# Altium schematic sheet S7CAS-PLEIADES-CARTE-MERE_Pxx_FLASH_PHY_CLOCK.SchDoc
size Tabloid; SheetNumber: 10; SheetTotal: 18; Sheet_Name: FLASH CLOCK; Size: 11x17
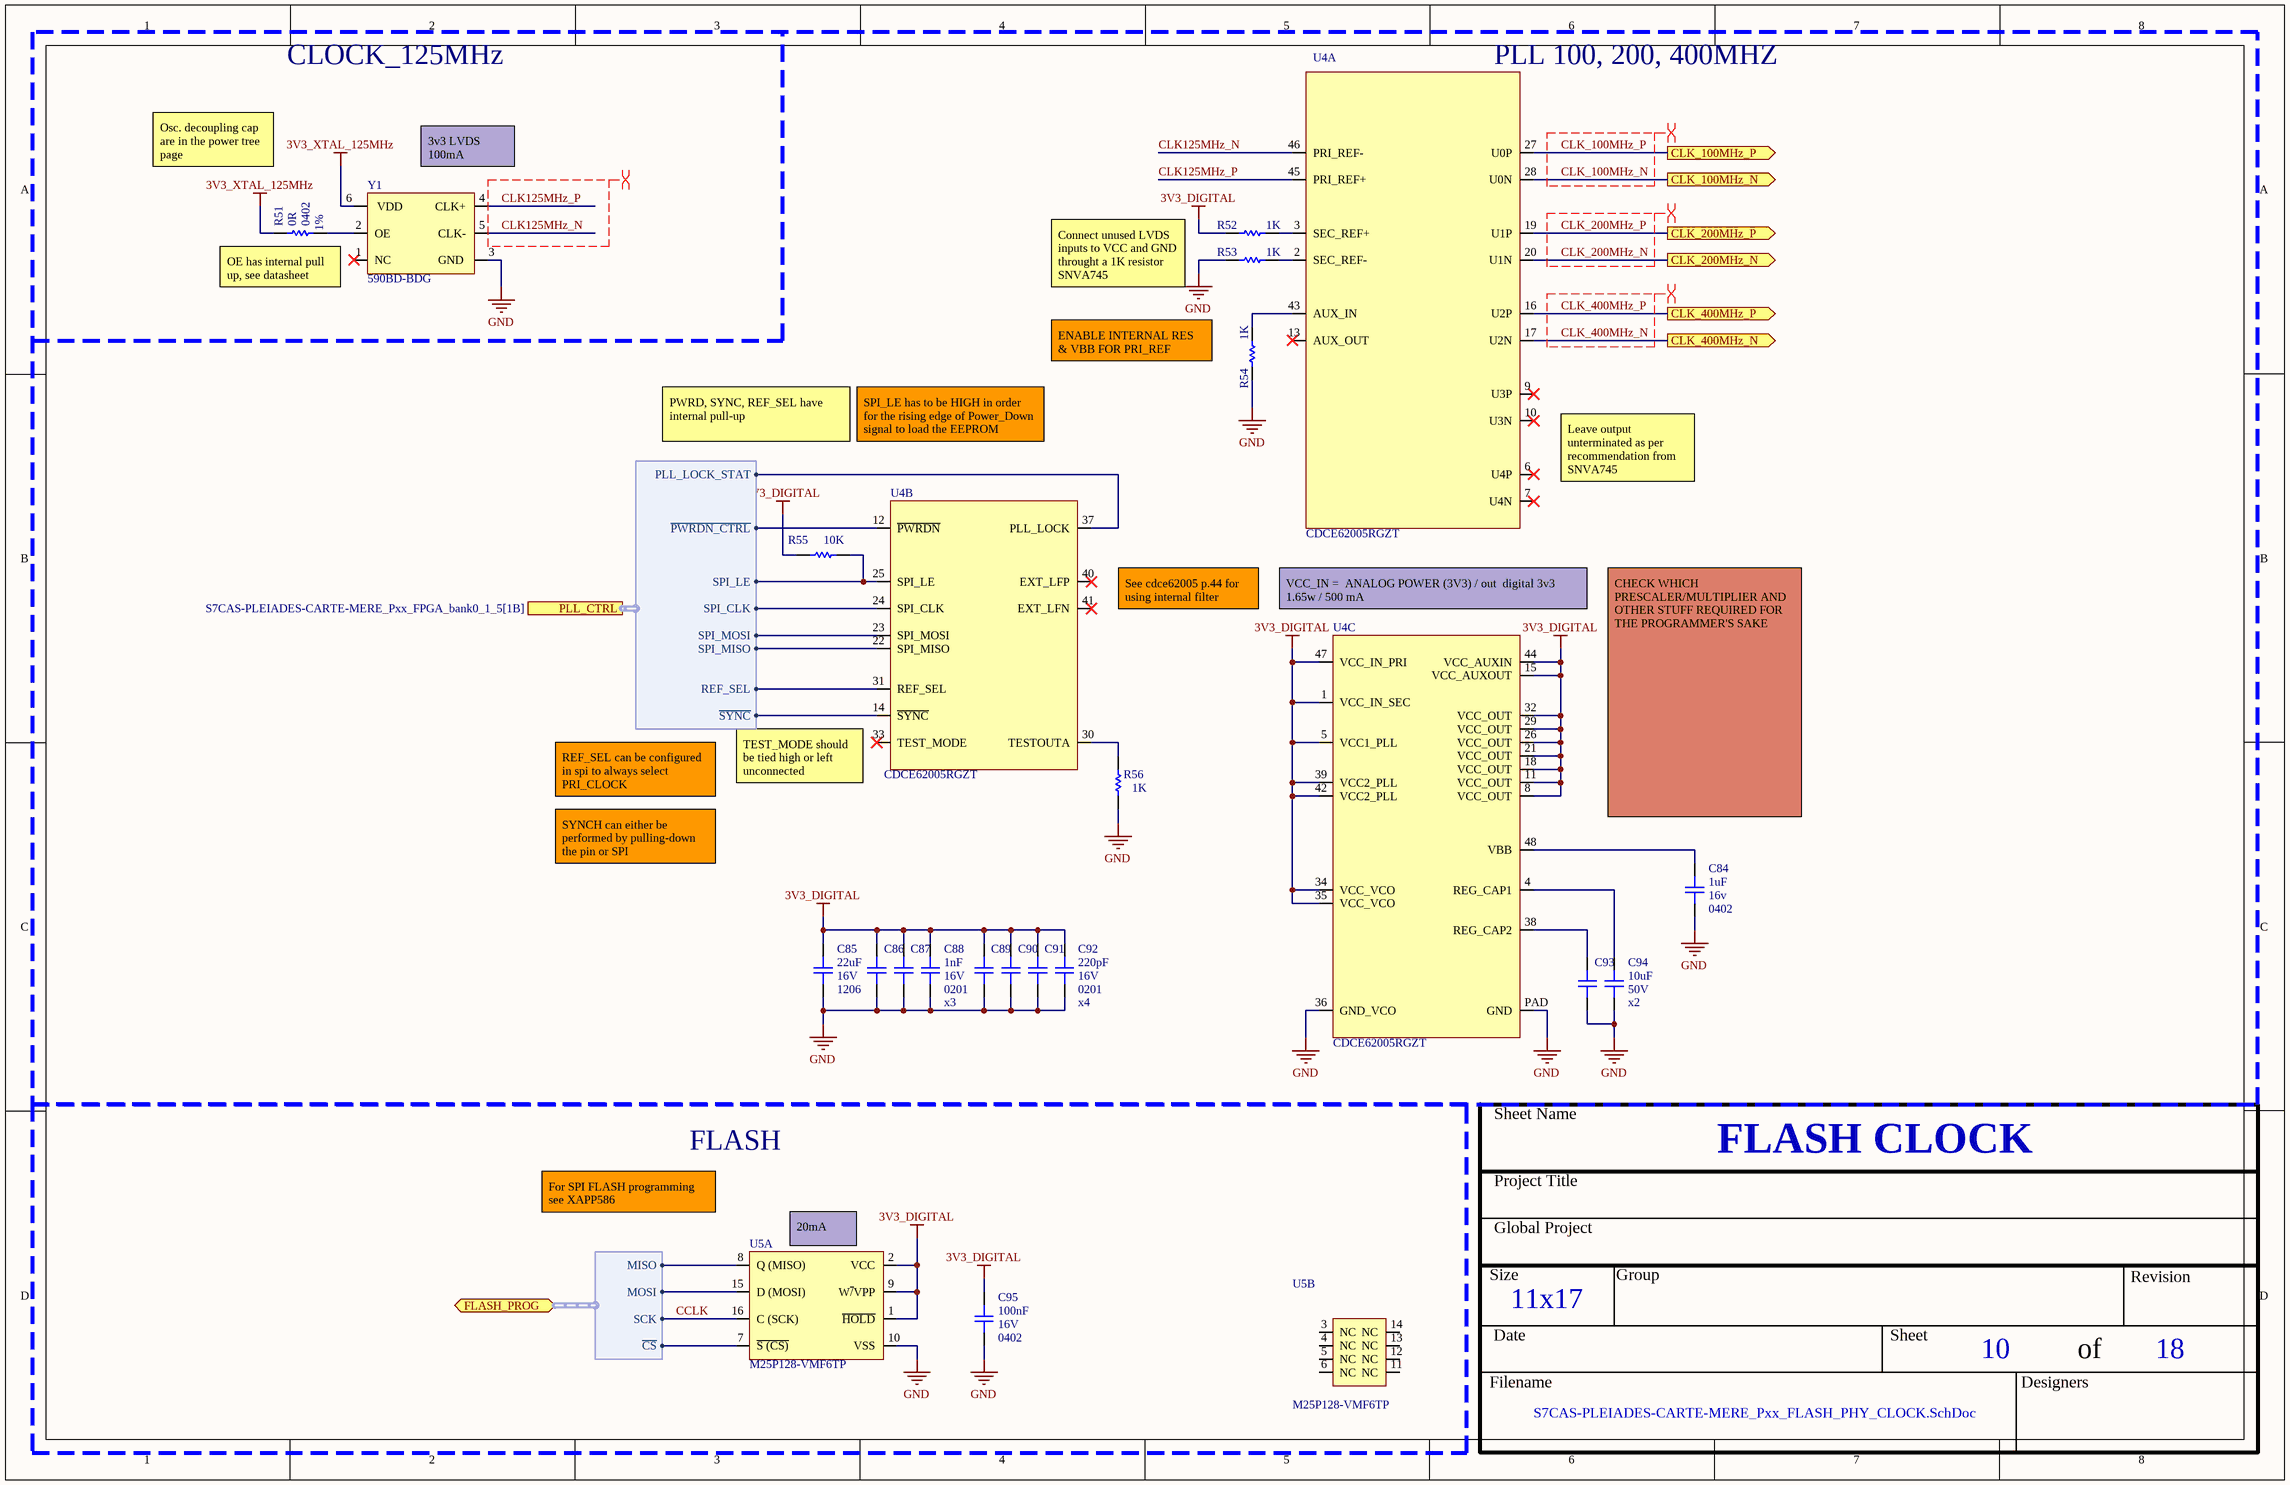
[diagram p0: S7CAS-PLEIADES-CARTE-MERE_Pxx_FLASH_PHY_CLOCK.SchDoc]

## Parts
C84  value 1uF  Voltage: 16v  [CAP_0402]  (hidden comment: 0402)
C85  value 22uF  Voltage: 16V  Package: 1206  [CAP_1206]  (hidden comment: CAP - 1206)
C86  CAP - 0201  [CAP_0201]  (value not drawn)
C87  CAP - 0201  [CAP_0201]  (value not drawn)
C88  value 1nF  Voltage: 16V  Package: 0201  [CAP_0201]  (hidden comment: CAP - 0201)
C89  CAP - 0201  [CAP_0201]  (value not drawn)
C90  CAP - 0201  [CAP_0201]  (value not drawn)
C91  CAP - 0201  [CAP_0201]  (value not drawn)
C92  value 220pF  Voltage: 16V  Package: 0201  [CAP_0201]  (hidden comment: CAP - 0201)
C93  CAP - 1206  [CAP_1206]  (value not drawn)
C94  value 10uF  Voltage: 50V  [CAP_1206]  (hidden comment: CAP - 1206)
C95  value 100nF  Voltage: 16V  [CAP_0402]  (hidden comment: 0402)
R51  value 0R  Package: 0402  Precision: 1%  [RES_0402]  (hidden comment: RES - 0603)
R52  value 1K  [RES_0402]  (hidden comment: RES - 0603)
R53  value 1K  [RES_0402]  (hidden comment: RES - 0603)
R54  value 1K  [RES_0402]  (hidden comment: RES - 0603)
R55  value 10K  [RES_0402]  (hidden comment: RES - 0603)
R56  value 1K  [RES_0402]  (hidden comment: RES - 0603)
U4  CDCE62005RGZT  [TIM_CDCE62005RGZT]  (parts A,B,C of 3)
U5  M25P128-VMF6TP  [FLASH - M25P128-VMF6TP]  (parts A,B of 2)
Y1  590BD-BDG  [OSC_590BD-BDG]

## Blocks framed on the sheet
FLASH: C95 U5

## Ports
CLK_100MHz_N (out, see S7CAS-PLEIADES-CARTE-MERE_Pxx_FPGA_bank0_1_5[4A]), CLK_100MHz_P (out, see S7CAS-PLEIADES-CARTE-MERE_Pxx_FPGA_bank0_1_5[4A]), CLK_200MHz_N (out, see S7CAS-PLEIADES-CARTE-MERE_Pxx_CAN[1C]), CLK_200MHz_P (out, see S7CAS-PLEIADES-CARTE-MERE_Pxx_CAN[1C]), CLK_400MHz_N (out, see S7CAS-PLEIADES-CARTE-MERE_Pxx_CNA[2C]), CLK_400MHz_P (out, see S7CAS-PLEIADES-CARTE-MERE_Pxx_CNA[2C]), FLASH_PROG (bidir, harness FLASH_PROG, see S7CAS-PLEIADES-CARTE-MERE_Pxx_FPGA_bank2_4[2D]), PLL_CTRL (harness PLL_CTRL, see S7CAS-PLEIADES-CARTE-MERE_Pxx_FPGA_bank0_1_5[1B])

## Harnesses
PLL_CTRL: ~{PWRDN_CTRL}, SPI_LE, SPI_CLK, SPI_MOSI, SPI_MISO, REF_SEL, ~{SYNC}, PLL_LOCK_STAT
FLASH_PROG: MISO, MOSI, SCK, ~{CS}

## Nets
3V3_DIGITAL: C85.2 C86.2 C87.2 C88.2 C89.2 C90.2 C91.2 C92.2 C95.2 R52.2 R55.2 U4.1(VCC_IN_SEC) U4.5(VCC1_PLL) U4.8(VCC_OUT) U4.11(VCC_OUT) U4.15(VCC_AUXOUT) U4.18(VCC_OUT) U4.21(VCC_OUT) U4.26(VCC_OUT) U4.29(VCC_OUT) U4.32(VCC_OUT) U4.34(VCC_VCO) U4.35(VCC_VCO) U4.39(VCC2_PLL) U4.42(VCC2_PLL) U4.44(VCC_AUXIN) U4.47(VCC_IN_PRI) U5.1(~{HOLD}) U5.2(VCC) U5.9(W~{/}VPP)
3V3_XTAL_125MHz: R51.2 Y1.6(VDD)
GND: C84.1 C85.1 C86.1 C87.1 C88.1 C89.1 C90.1 C91.1 C92.1 C93.1 C94.1 C95.1 R53.2 R54.2 R56.1 U4.36(GND_VCO) U4.PAD(GND) U5.10(VSS) Y1.3(GND)
CCLK: U5.16(C_(SCK)) ; port FLASH_PROG.SCK
CLK125MHz_N: U4.46(PRI_REF-) Y1.5(CLK-)
CLK125MHz_P: U4.45(PRI_REF+) Y1.4(CLK+)
CLK_100MHz_N: U4.28(U0N) ; port CLK_100MHz_N
CLK_100MHz_P: U4.27(U0P) ; port CLK_100MHz_P
CLK_200MHz_N: U4.20(U1N) ; port CLK_200MHz_N
CLK_200MHz_P: U4.19(U1P) ; port CLK_200MHz_P
CLK_400MHz_N: U4.17(U2N) ; port CLK_400MHz_N
CLK_400MHz_P: U4.16(U2P) ; port CLK_400MHz_P
NetC84_2: C84.2 U4.48(VBB)
NetC93_2: C93.2 U4.38(REG_CAP2)
NetC94_2: C94.2 U4.4(REG_CAP1)
NetR51_1: R51.1 Y1.2(OE)
NetR52_1: R52.1 U4.3(SEC_REF+)
NetR53_1: R53.1 U4.2(SEC_REF-)
NetR54_1: R54.1 U4.43(AUX_IN)
NetR55_1: R55.1 U4.25(SPI_LE) ; port PLL_CTRL.SPI_LE
NetR56_2: R56.2 U4.30(TESTOUTA)
NetU4_12: U4.12(~{PWRDN}) ; port PLL_CTRL.~{PWRDN_CTRL}
NetU4_14: U4.14(~{SYNC}) ; port PLL_CTRL.~{SYNC}
NetU4_22: U4.22(SPI_MISO) ; port PLL_CTRL.SPI_MISO
NetU4_23: U4.23(SPI_MOSI) ; port PLL_CTRL.SPI_MOSI
NetU4_24: U4.24(SPI_CLK) ; port PLL_CTRL.SPI_CLK
NetU4_31: U4.31(REF_SEL) ; port PLL_CTRL.REF_SEL
NetU4_37: U4.37(PLL_LOCK) ; port PLL_CTRL.PLL_LOCK_STAT
NetU5_7: U5.7(~{S_(CS)}) ; port FLASH_PROG.~{CS}
NetU5_8: U5.8(Q_(MISO)) ; port FLASH_PROG.MISO
NetU5_15: U5.15(D_(MOSI)) ; port FLASH_PROG.MOSI

Not connected (* = marked no-connect by the designer): U4 6(U4P)* 7(U4N)* 9(U3P)* 10(U3N)* 13(AUX_OUT)* 33(TEST_MODE)* 40(EXT_LFP)* 41(EXT_LFN)*; U5 3(NC) 4(NC) 5(NC) 6(NC) 11(NC) 12(NC) 13(NC) 14(NC); Y1 1(NC)*

## Layout directives
differential pair; differential pair class XTAL_CLK_125MHz; differential pair class LVDS: CLK125MHz_N, CLK125MHz_P
differential pair; differential pair class CLK_100MHz; differential pair class LVDS: CLK_100MHz_N, CLK_100MHz_P
differential pair; differential pair class CLK_200MHz; differential pair class LVDS: CLK_200MHz_N, CLK_200MHz_P
differential pair; differential pair class CLK_400MHz; differential pair class LVDS: CLK_400MHz_N, CLK_400MHz_P

## Notes on the sheet
- CLOCK_125MHz
- PLL 100, 200, 400MHZ
- Osc. decoupling cap are in the power tree page
- (near Y1) 3v3 LVDS 100mA
- (near R51) OE has internal pull up, see datasheet
- Connect unused LVDS inputs to VCC and GND throught a 1K resistor
  SNVA745
- (near R54) ENABLE INTERNAL RES & VBB FOR PRI_REF
- PWRD, SYNC, REF_SEL have internal pull-up
- SPI_LE has to be HIGH in order for the rising edge of Power_Down signal to load the EEPROM
- (near U4) Leave output unterminated as per recommendation from SNVA745
- (near U4) See cdce62005 p.44 for using internal filter
- VCC_IN =  ANALOG POWER (3V3) / out  digital 3v3
  1.65w / 500 mA
- REF_SEL can be configured in spi to always select PRI_CLOCK
- (near U4) TEST_MODE should be tied high or left unconnected
- CHECK WHICH PRESCALER/MULTIPLIER AND OTHER STUFF REQUIRED FOR THE PROGRAMMER'S SAKE
- SYNCH can either be performed by pulling-down the pin or SPI
- x3
- (near C92) x4
- (near C94) x2
- For SPI FLASH programming see XAPP586
- (near U5) 20mA
- Sheet Name
- Project Title
- Global Project
- Size
- Group
- Revision
- Date
- Sheet
- of
- Filename
- Designers

## Library data of the parts
C84 C95 = CAP - 0603: CAP - 0402; Precision: 10%; Current: *; CreatedBy: Jonathan Bouchard; Power: *; Package: 0402; Supplier 1: Arrow Electronics
  C84: Supplier Part Number 1: CL10B105MO8NNWC
  C95: Supplier Part Number 1: CL10B104KO8NNNC
C85 C94 = CAP - 1206: Precision: 10%; Current: *; CreatedBy: Jonathan Bouchard; Power: *
  C85: Supplier 1: Arrow Electronics; Supplier Part Number 1: CL31A226MOCLNNC
  C94: Package: 1206; Supplier 1: Avnet; Supplier Part Number 1: CL31A106MBHNNNE
C86 C87 = CAP - 0201: Precision: 10%; Voltage: 16V; Value: 1nF; Current: *; CreatedBy: Jonathan Bouchard; Power: *; Package: 0201; Supplier 1: Avnet; Supplier Part Number 1: GRM033R71C102KA01J
C88 C92 = CAP - 0201: Precision: 10%; Current: *; CreatedBy: Jonathan Bouchard; Power: *
  C88: Supplier 1: Avnet; Supplier Part Number 1: GRM033R71C102KA01J
  C92: Supplier 1: Arrow Electronics; Supplier Part Number 1: GRM033R71C221KA01D
C89-C91 = CAP - 0201: Precision: 10%; Voltage: 16V; Value: 220pF; Current: *; CreatedBy: Jonathan Bouchard; Power: *; Package: 0201; Supplier 1: Arrow Electronics; Supplier Part Number 1: GRM033R71C221KA01D
C93 = CAP - 1206: Precision: 10%; Voltage: 50V; Value: 10uF; Current: *; CreatedBy: Jonathan Bouchard; Power: *; Package: 1206; Supplier 1: Avnet; Supplier Part Number 1: CL31A106MBHNNNE
R51 = RES - 0603: RES - 0402; Current: *; CreatedBy: Jonathan Bouchard; Supplier 1: Arrow Electronics; Supplier Part Number 1: RMCF0603ZT0R00
R52-R56 = RES - 0603: RES - 0402; Precision: 1%; Current: *; CreatedBy: Jonathan Bouchard; Package: 0402
  R52-R54: Supplier 1: Mouser; Supplier Part Number 1: 71-CRCW0603-10K-E3
  R55: Supplier 1: Arrow Electronics; Supplier Part Number 1: RMCF0603FT10K0
  R56: Supplier 1: Arrow Electronics; Supplier Part Number 1: RMCF0603FT1K00
U4 = TIM_CDCE62005RGZT: TIM - CLK SYNTH JITTER CLEANER 3:5 - QFN-48; Voltage: 3 V ~ 3.6 V; Mfg: Texas Instruments; Current: *; Power: *; Mfg Part Number: CDCE62005RGZT; HelpURL: http://www.ti.com/lit/ds/symlink/cdce62005.pdf; CreatedBy: Jonathan Bouchard; Temperature: -40°C ~ 85°C; Value: *; Precision: *; Package: QFN-48; Supplier 1: Digikey; Supplier Part Number 1: 296-23947-1-ND
U5 = FLASH  - M25P128-VMF6TP: 128-Mbit, low-voltage, serial flash memory / with 54-MHz SPI bus interface; GRAMS Lib Spec: 2.7; Supplier 1: Digikey; Supplier Part Number 1: M25P128-VMF6TP CT-ND
Y1 = OSC_590BD-BDG: TIM - OSC PROG 125MHz ~ 214.999MHz LVDS 3.3V 7PPM EN/DS - 6-SMD; Manufacturer #1: Silicon Labs; Current Rating: 100 mA (supply); Note: Spécifié la fréquence lors de la commande; Voltage rating: 3.3V (supply); Polarized: Yes; Value: ±7ppm (freq Stability), ±20ppm (freq stability total); Magnetic Material: UNKNOWN; GRAMS Lib Spec: 2.8; Manufacturer #2: *; Power Max: *; Part Number #1: 590BD-BDG; Part Number #2: *; HelpURL: https://www.silabs.com/documents/public/data-sheets/Si590-591.pdf; Supplier 1: Digi-Key; Supplier Part Number 1: 590BD-BDG-ND; Assembly Type: SMD; Temperature: -40°C ~ 85°C; Package: 6-SMD; CreatedBy/Date: from 590BD-CDG; Tolerance: *; VerifiedBy: Caroline Paulin / 3/10/2019; Cryo: UNKNOWN